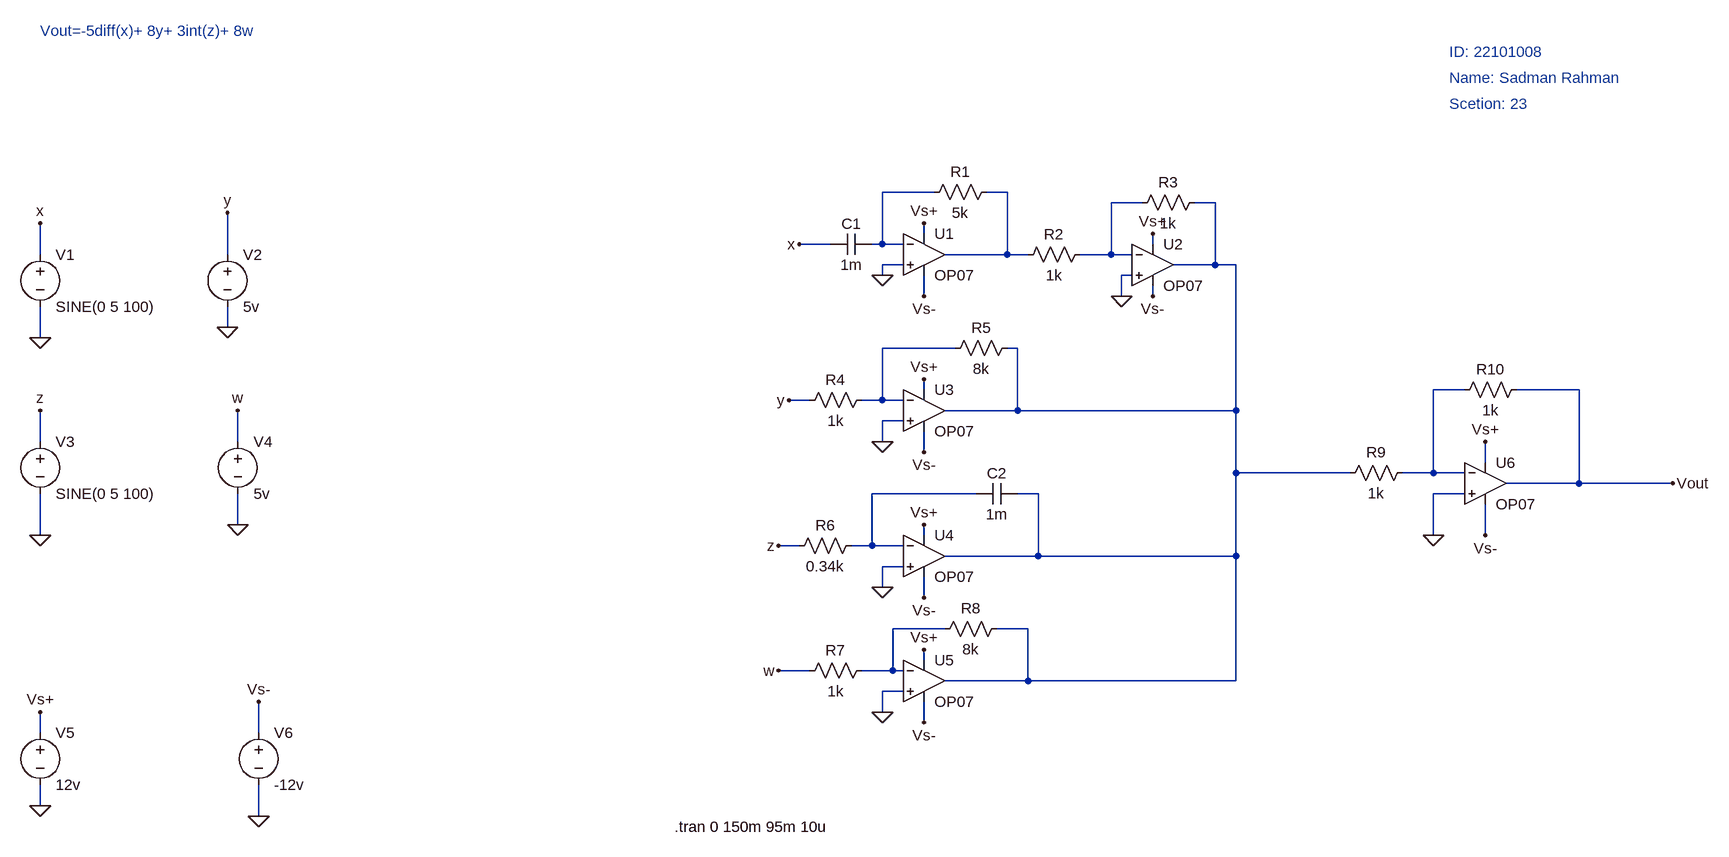
[diagram p0: schematic Project.asc.asc]
Project.asc.asc, the LTspice schematic file:
Version 4
SHEET 1 1272 952
WIRE 64 -48 -16 -48
WIRE 176 -48 144 -48
WIRE 384 -32 336 -32
WIRE 496 -32 464 -32
WIRE 48 16 48 0
WIRE -96 32 -144 32
WIRE -16 32 -16 -48
WIRE -16 32 -32 32
WIRE 16 32 -16 32
WIRE 400 32 400 16
WIRE -1312 48 -1312 0
WIRE -1024 48 -1024 -16
WIRE 176 48 176 -48
WIRE 176 48 80 48
WIRE 208 48 176 48
WIRE 336 48 336 -32
WIRE 336 48 288 48
WIRE 368 48 336 48
WIRE 16 64 -16 64
WIRE 496 64 496 -32
WIRE 496 64 432 64
WIRE 528 64 496 64
WIRE -16 80 -16 64
WIRE 368 80 352 80
WIRE 48 112 48 80
WIRE 352 112 352 80
WIRE 400 112 400 96
WIRE -1024 160 -1024 128
WIRE -1312 176 -1312 128
WIRE 96 192 -16 192
WIRE 192 192 176 192
WIRE 48 256 48 240
WIRE 880 256 832 256
WIRE 1056 256 960 256
WIRE -128 272 -160 272
WIRE -16 272 -16 192
WIRE -16 272 -48 272
WIRE 16 272 -16 272
WIRE 192 288 192 192
WIRE 192 288 80 288
WIRE 528 288 528 64
WIRE 528 288 192 288
WIRE 16 304 -16 304
WIRE -1312 336 -1312 288
WIRE -1008 336 -1008 288
WIRE -16 336 -16 304
WIRE 48 352 48 320
WIRE 912 368 912 336
WIRE 528 384 528 288
WIRE 704 384 528 384
WIRE 832 384 832 256
WIRE 832 384 784 384
WIRE 880 384 832 384
WIRE 1056 400 1056 256
WIRE 1056 400 944 400
WIRE 1200 400 1056 400
WIRE 128 416 -32 416
WIRE 224 416 192 416
WIRE 880 416 832 416
WIRE -1008 464 -1008 416
WIRE -1312 480 -1312 416
WIRE 48 480 48 464
WIRE 832 480 832 416
WIRE 912 480 912 432
WIRE -144 496 -176 496
WIRE -32 496 -32 416
WIRE -32 496 -64 496
WIRE 16 496 -32 496
WIRE 224 512 224 416
WIRE 224 512 80 512
WIRE 528 512 528 384
WIRE 528 512 224 512
WIRE 16 528 -16 528
WIRE -16 560 -16 528
WIRE 48 576 48 544
WIRE 80 624 0 624
WIRE 208 624 160 624
WIRE 48 672 48 656
WIRE -128 688 -176 688
WIRE 0 688 0 624
WIRE 0 688 -48 688
WIRE 16 688 0 688
WIRE 208 704 208 624
WIRE 208 704 80 704
WIRE 528 704 528 512
WIRE 528 704 208 704
WIRE 16 720 -16 720
WIRE -16 752 -16 720
WIRE 48 768 48 736
WIRE -1312 784 -1312 752
WIRE -976 784 -976 736
WIRE -1312 896 -1312 864
WIRE -976 912 -976 864
FLAG -16 80 0
FLAG -144 32 x
FLAG 352 112 0
FLAG -16 336 0
FLAG -160 272 y
FLAG -16 560 0
FLAG -16 752 0
FLAG -176 496 z
FLAG -176 688 w
FLAG 832 480 0
FLAG 48 0 Vs+
FLAG 48 240 Vs+
FLAG 48 464 Vs+
FLAG 912 336 Vs+
FLAG 48 112 Vs-
FLAG 48 352 Vs-
FLAG 48 576 Vs-
FLAG 48 768 Vs-
FLAG 912 480 Vs-
FLAG 1200 400 Vout
FLAG -1312 176 0
FLAG -1024 160 0
FLAG -1312 480 0
FLAG -1008 464 0
FLAG -976 912 0
FLAG -1312 896 0
FLAG -1312 0 x
FLAG -1024 -16 y
FLAG -1312 288 z
FLAG -1008 288 w
FLAG -1312 752 Vs+
FLAG -976 736 Vs-
FLAG 400 16 Vs+
FLAG 400 112 Vs-
FLAG 48 656 Vs+
SYMBOL cap -32 16 R90
WINDOW 0 0 32 VBottom 2
WINDOW 3 32 32 VTop 2
SYMATTR InstName C1
SYMATTR Value 1m
SYMBOL res 160 -64 R90
WINDOW 0 0 56 VBottom 2
WINDOW 3 32 56 VTop 2
SYMATTR InstName R1
SYMATTR Value 5k
SYMBOL res 304 32 R90
WINDOW 0 0 56 VBottom 2
WINDOW 3 32 56 VTop 2
SYMATTR InstName R2
SYMATTR Value 1k
SYMBOL res 480 -48 R90
WINDOW 0 0 56 VBottom 2
WINDOW 3 32 56 VTop 2
SYMATTR InstName R3
SYMATTR Value 1k
SYMBOL OpAmps\\OP07 400 0 R0
SYMATTR InstName U2
SYMBOL OpAmps\\OP07 48 224 R0
SYMATTR InstName U3
SYMBOL res -32 256 R90
WINDOW 0 0 56 VBottom 2
WINDOW 3 32 56 VTop 2
SYMATTR InstName R4
SYMATTR Value 1k
SYMBOL OpAmps\\OP07 48 448 R0
SYMATTR InstName U4
SYMBOL res -48 480 R90
WINDOW 0 0 56 VBottom 2
WINDOW 3 32 56 VTop 2
SYMATTR InstName R6
SYMATTR Value 0.34k
SYMBOL OpAmps\\OP07 48 640 R0
SYMATTR InstName U5
SYMBOL res -32 672 R90
WINDOW 0 0 56 VBottom 2
WINDOW 3 32 56 VTop 2
SYMATTR InstName R7
SYMATTR Value 1k
SYMBOL res 176 608 R90
WINDOW 0 0 56 VBottom 2
WINDOW 3 32 56 VTop 2
SYMATTR InstName R8
SYMATTR Value 8k
SYMBOL OpAmps\\OP07 912 336 R0
SYMATTR InstName U6
SYMBOL res 800 368 R90
WINDOW 0 0 56 VBottom 2
WINDOW 3 32 56 VTop 2
SYMATTR InstName R9
SYMATTR Value 1k
SYMBOL res 976 240 R90
WINDOW 0 0 56 VBottom 2
WINDOW 3 32 56 VTop 2
SYMATTR InstName R10
SYMATTR Value 1k
SYMBOL res 192 176 R90
WINDOW 0 0 56 VBottom 2
WINDOW 3 32 56 VTop 2
SYMATTR InstName R5
SYMATTR Value 8k
SYMBOL cap 192 400 R90
WINDOW 0 0 32 VBottom 2
WINDOW 3 32 32 VTop 2
SYMATTR InstName C2
SYMATTR Value 1m
SYMBOL voltage -1312 32 R0
WINDOW 123 0 0 Left 0
WINDOW 39 0 0 Left 0
SYMATTR InstName V1
SYMATTR Value SINE(0 5 100)
SYMBOL voltage -1024 32 R0
WINDOW 123 0 0 Left 0
WINDOW 39 0 0 Left 0
SYMATTR InstName V2
SYMATTR Value 5v
SYMBOL voltage -1312 320 R0
WINDOW 123 0 0 Left 0
WINDOW 39 0 0 Left 0
SYMATTR InstName V3
SYMATTR Value SINE(0 5 100)
SYMBOL voltage -1008 320 R0
WINDOW 123 0 0 Left 0
WINDOW 39 0 0 Left 0
SYMATTR InstName V4
SYMATTR Value 5v
SYMBOL voltage -1312 768 R0
SYMATTR InstName V5
SYMATTR Value 12v
SYMBOL voltage -976 768 R0
WINDOW 123 0 0 Left 0
WINDOW 39 0 0 Left 0
SYMATTR InstName V6
SYMATTR Value -12v
SYMBOL OpAmps\\OP07 48 -16 R0
SYMATTR InstName U1
TEXT -336 928 Left 2 !.tran 0 150m 95m 10u
TEXT 856 -264 Left 2 ;ID: 22101008
TEXT 856 -224 Left 2 ;Name: Sadman Rahman
TEXT 856 -184 Left 2 ;Scetion: 23
TEXT -1312 -296 Left 2 ;Vout=-5diff(x)+ 8y+ 3int(z)+ 8w

The netlist it stands for:
* Project.asc.asc
C1 N001 x 1m
R1 N002 N001 5k
R2 N003 N002 1k
R3 N004 N003 1k
XU2 0 N003 Vs+ Vs- N004 LT1001  ; OP07, pins In+ In- V+ V- OUT
XU3 0 N005 Vs+ Vs- N004 LT1001  ; OP07, pins In+ In- V+ V- OUT
R4 N005 y 1k
XU4 0 N007 Vs+ Vs- N004 LT1001  ; OP07, pins In+ In- V+ V- OUT
R6 N007 z 0.34k
XU5 0 N008 Vs+ Vs- N004 LT1001  ; OP07, pins In+ In- V+ V- OUT
R7 N008 w 1k
R8 N004 N008 8k
XU6 0 N006 Vs+ Vs- Vout LT1001  ; OP07, pins In+ In- V+ V- OUT
R9 N006 N004 1k
R10 Vout N006 1k
R5 N004 N005 8k
C2 N004 N007 1m
V1 x 0 SINE(0 5 100)
V2 y 0 5v
V3 z 0 SINE(0 5 100)
V4 w 0 5v
V5 Vs+ 0 12v
V6 Vs- 0 -12v
XU1 0 N001 Vs+ Vs- N002 LT1001  ; OP07, pins In+ In- V+ V- OUT
.tran 0 150m 95m 10u
* ID: 22101008
* Name: Sadman Rahman
* Scetion: 23
* Vout=-5diff(x)+ 8y+ 3int(z)+ 8w
.lib LTC.lib
.backanno
.end